# EAGLE design atmega328p (EAGLE 8.5.0)
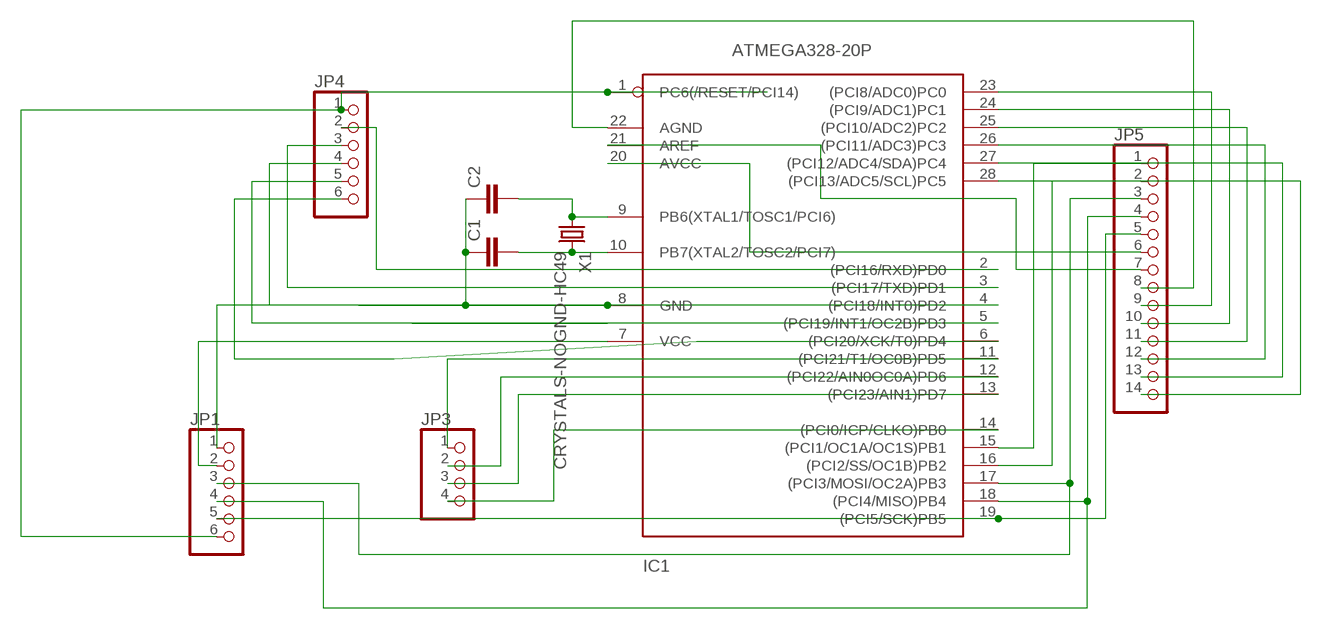
[diagram p0: schematic, sheet 1]

## Parts
C1  C5/2.5  [C5B2.5]
C2  C2.5/2  [C2.5-2]
IC1  ATMEGA328-20P  [DIL28-3]
JP1  PINHD-1X6  [1X06]
JP3  PINHD-1X4  [1X04]
JP4  PINHD-1X6  [1X06]
JP5  PINHD-1X14  [1X14]
X1  CRYSTALS-NOGND-HC49  [HC49]

## Nets
N$1: IC1.7(VCC) JP1.2
N$2: IC1.2((PCI16/RXD)PD0) JP4.2
N$3: C2.2 IC1.9(PB6(XTAL1/TOSC1/PCI6)) X1.1
N$4: C1.2 IC1.10(PB7(XTAL2/TOSC2/PCI7)) X1.2
N$5: C1.1 C2.1 IC1.8(GND) JP1.1
N$6: IC1.3((PCI17/TXD)PD1) JP4.3
N$7: IC1.1(PC6(/RESET/PCI14)) JP1.6 JP4.1
N$8: IC1.17((PCI3/MOSI/OC2A)PB3) JP1.3 JP5.3
N$10: IC1.19((PCI5/SCK)PB5) JP1.5 JP5.5
N$11: IC1.4((PCI18/INT0)PD2) JP4.4
N$12: IC1.5((PCI19/INT1/OC2B)PD3) JP4.5
N$13: IC1.6((PCI20/XCK/T0)PD4) JP4.6
N$14: IC1.11((PCI21/T1/OC0B)PD5) JP3.1
N$15: IC1.12((PCI22/AIN0OC0A)PD6) JP3.2
N$16: IC1.13((PCI23/AIN1)PD7) JP3.3
N$17: IC1.14((PCI0/ICP/CLKO)PB0) JP3.4
N$18: IC1.15((PCI1/OC1A/OC1S)PB1) JP5.1
N$19: IC1.16((PCI2/SS/OC1B)PB2) JP5.2
N$21: IC1.23((PCI8/ADC0)PC0) JP5.9
N$22: IC1.24((PCI9/ADC1)PC1) JP5.10
N$23: IC1.21(AREF) JP5.7
N$24: IC1.25((PCI10/ADC2)PC2) JP5.11
N$25: IC1.26((PCI11/ADC3)PC3) JP5.12
N$26: IC1.27((PCI12/ADC4/SDA)PC4) JP5.13
N$27: IC1.28((PCI13/ADC5/SCL)PC5) JP5.14
N$28: IC1.20(AVCC) JP5.6
N$30: IC1.22(AGND) JP5.8
N$31: IC1.18((PCI4/MISO)PB4) JP1.4 JP5.4

## Library data of the parts
C1 C2 = capacitor-wima:C: CAPACITOR naming: grid - package width
IC1 = atmega328:ATMEGA328*P: MICROCONTROLLER 32 kBytes FLASH 2 kBytes SRAM 1 kBytes EEPROM USART 8-channel 10 bit ADC
JP1 JP4 = pinhead:PINHD-1X6: PIN HEADER
JP3 = pinhead:PINHD-1X4: PIN HEADER
JP5 = pinhead:PINHD-1X14: PIN HEADER
X1 = IQD-Frequency-Products:CRYSTALS-NOGND: CRYSTALS CAN NOT GROUNDED

## Board
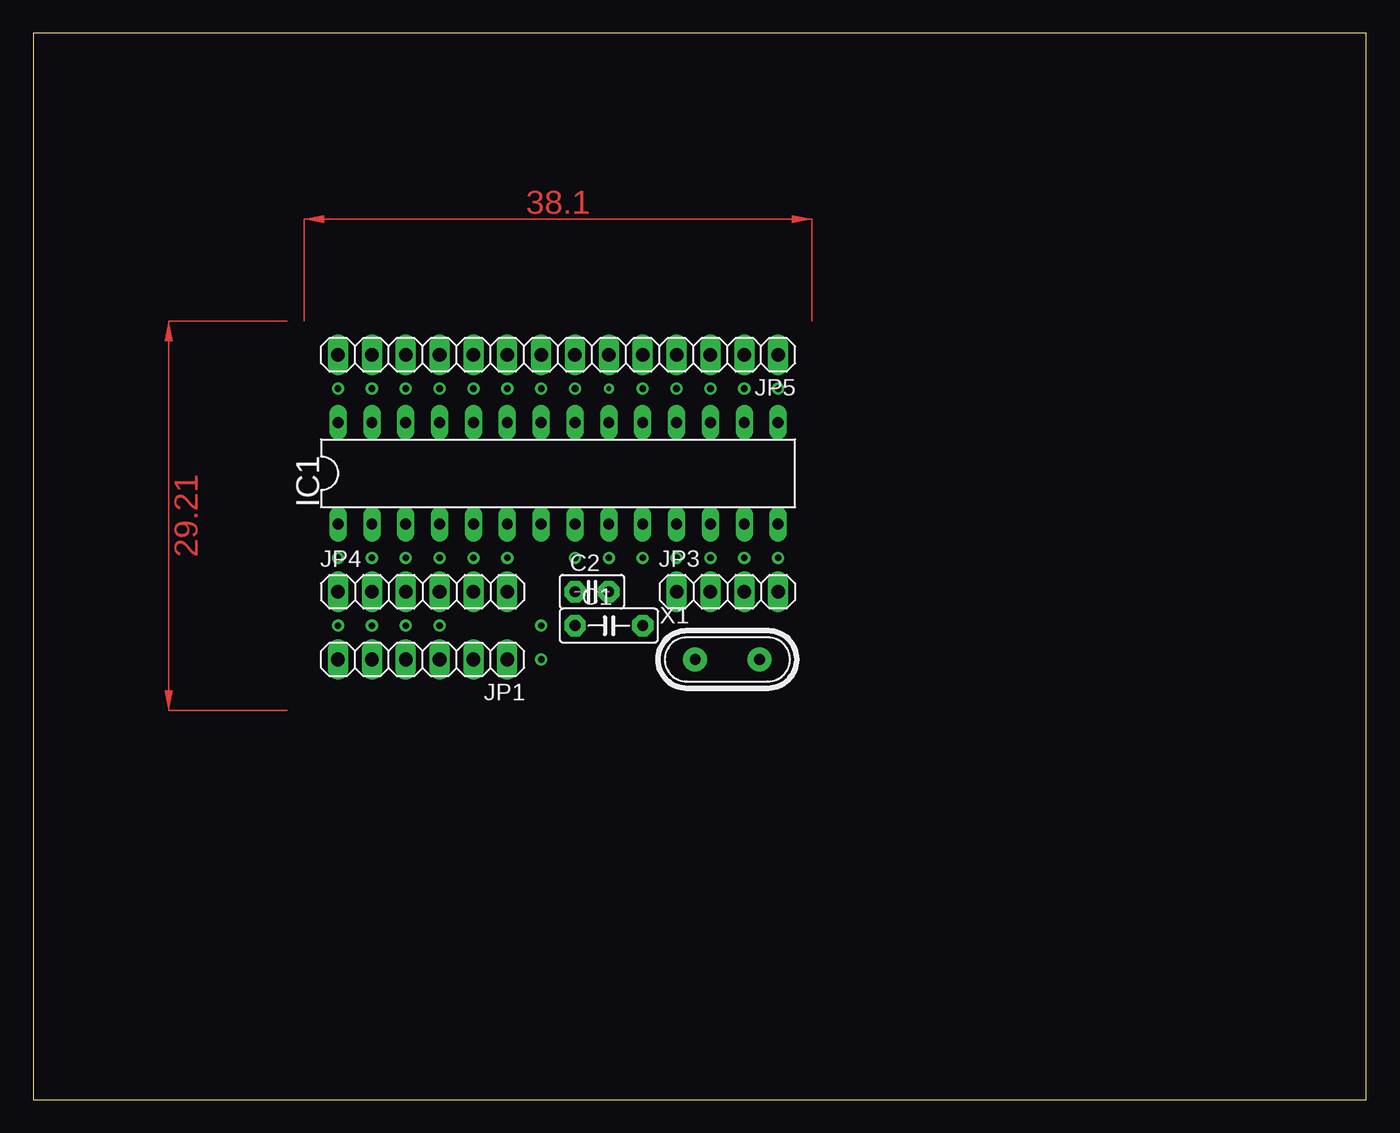
[diagram p1: board, top side]
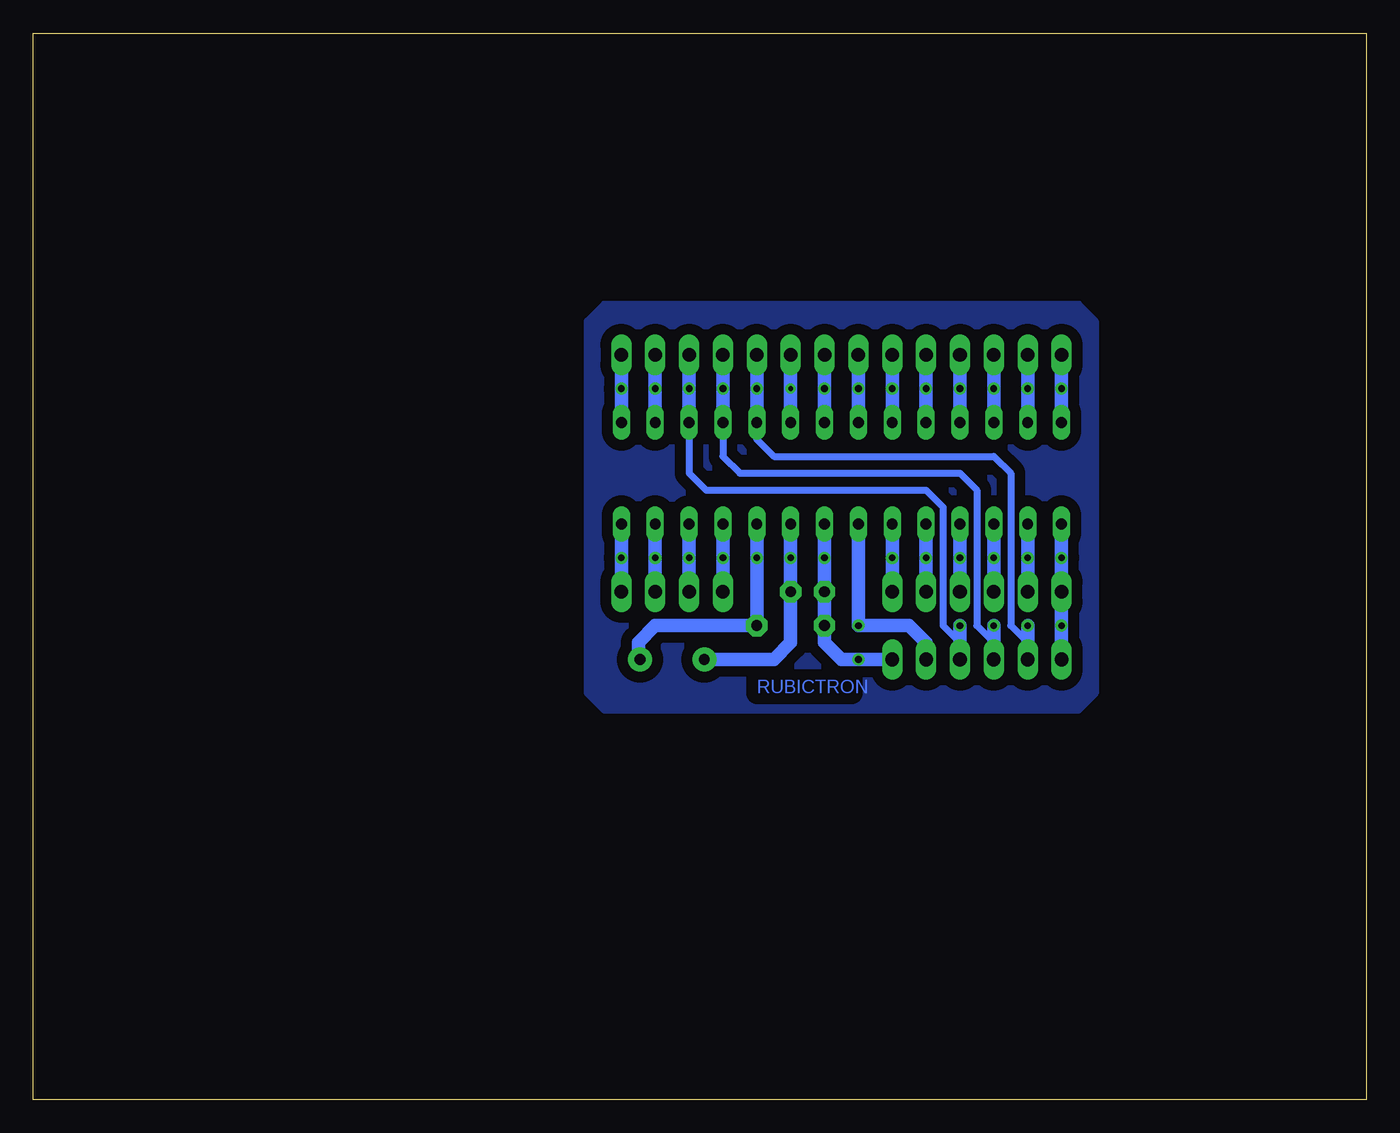
[diagram p2: board, bottom side, seen from below]

Size 100 x 80 mm. Coordinates in mm from the lower left corner, seen from the top.
Outline: 0,0 100,0 100,80 0,80 0,0
Copper layers (1*16): Top 0.035mm / dielectric 1.5mm / Bottom 0.035mm
Design rules "default": minimum track width 6mil, minimum drill 0.35mm, track to track 6mil, track to pad 6mil, pad to pad 6mil, via to via 6mil, smd to smd 6mil, copper to edge 40mil, drill to drill 6mil, minimum pad ring 10mil, minimum via ring 8mil, stop-mask expansion 4mil, vias tented up to drill 0mil, thermal gap 10mil

### Footprints (pad centres in the part's own frame; a part is rotated, then mirrored left to right if it is on the bottom)
C5B2.5 = drill 0.813 pad 1.6 octagon: 1 -2.54,0; 2 2.54,0
C2.5-2 = drill 0.813 pad 1.6 octagon: 1 -1.27,0; 2 1.27,0
DIL28-3 = drill 0.813 long: 1 -16.51,-3.81; 2 -13.97,-3.81; 3 -11.43,-3.81; 4 -8.89,-3.81; 5 -6.35,-3.81; 6 -3.81,-3.81; 7 -1.27,-3.81; 8 1.27,-3.81; 9 3.81,-3.81; 10 6.35,-3.81; 11 8.89,-3.81; 12 11.43,-3.81; 13 13.97,-3.81; 14 16.51,-3.81; 15 16.51,3.81; 16 13.97,3.81; 17 11.43,3.81; 18 8.89,3.81; 19 6.35,3.81; 20 3.81,3.81; 21 1.27,3.81; 22 -1.27,3.81; 23 -3.81,3.81; 24 -6.35,3.81; 25 -8.89,3.81; 26 -11.43,3.81; 27 -13.97,3.81; 28 -16.51,3.81
1X06 = drill 1.016 long: 1 -6.35,0; 2 -3.81,0; 3 -1.27,0; 4 1.27,0; 5 3.81,0; 6 6.35,0
1X04 = drill 1.016 long: 1 -3.81,0; 2 -1.27,0; 3 1.27,0; 4 3.81,0
1X14 = drill 1.016 long: 1 -16.51,0; 2 -13.97,0; 3 -11.43,0; 4 -8.89,0; 5 -6.35,0; 6 -3.81,0; 7 -1.27,0; 8 1.27,0; 9 3.81,0; 10 6.35,0; 11 8.89,0; 12 11.43,0; 13 13.97,0; 14 16.51,0
HC49 = drill 0.813 pad 1.8: 1 -2.413,0; 2 2.413,0

### Placement (x,y rotation side)
C1  43.18,35.56 0 top
C2  41.91,38.1 0 top
IC1  39.37,46.99 0 top
JP1  29.21,33.02 180 top
JP3  52.07,38.1 0 top
JP4  29.21,38.1 0 top
JP5  39.37,55.88 180 top
X1  52.07,33.02 0 top

### Tracks (layer width: path | path; a pad name or v marks a point on that pad's centre or on a via)
N$1  (via drill 0.5)
  Bottom 1.016: JP1.2 33.02,34.29 34.29,35.56 v38.1,35.56 IC1.7
N$2  (via drill 0.5)
  Bottom 1.016: IC1.2 v25.4,40.64 JP4.2
N$3  (via drill 0.5)
  Bottom 1.016: IC1.9 v43.18,40.64 C2.2 43.18,34.29 44.45,33.02 X1.1
N$4  (via drill 0.5)
  Bottom 1.016: IC1.10 v45.72,40.64 C1.2 53.34,35.56 54.61,34.29 54.61,33.02 X1.2
N$5  (via drill 0.35, 0.5)
  Bottom 1.016: IC1.8 v40.64,40.64 C2.1 C1.1 40.64,34.29 39.37,33.02 v38.1,33.02 JP1.1
  other vias: 40.64,43.18
N$6  (via drill 0.5)
  Bottom 1.016: IC1.3 v27.94,40.64 JP4.3
N$7  (via drill 0.5)
  Bottom 1.016: IC1.1 v22.86,40.64 JP4.1 v22.86,35.56 JP1.6
N$8  (via drill 0.5)
  Bottom 0.508: IC1.17 50.8,46.99 49.53,45.72 33.02,45.72 31.75,44.45 31.75,35.56 30.48,34.29 JP1.3
  Bottom 1.016: JP5.3 v50.8,53.34 IC1.17 | v30.48,35.56 JP1.3
N$10  (via drill 0.5)
  Bottom 0.508: IC1.19 45.72,49.53 44.45,48.26 27.94,48.26 26.67,46.99 26.67,35.56 | 26.67,35.56 25.4,34.29 | 26.67,35.56
  Bottom 1.016: JP5.5 v45.72,53.34 IC1.19 | JP1.5 25.4,34.29 v25.4,35.56
N$11  (via drill 0.5)
  Bottom 1.016: IC1.4 v30.48,40.64 JP4.4
N$12  (via drill 0.5)
  Bottom 1.016: IC1.5 v33.02,40.64 JP4.5
N$13  (via drill 0.5)
  Bottom 1.016: JP4.6 v35.56,40.64 IC1.6
N$14  (via drill 0.5)
  Bottom 1.016: IC1.11 v48.26,40.64 JP3.1
N$15  (via drill 0.5)
  Bottom 1.016: IC1.12 v50.8,40.64 JP3.2
N$16  (via drill 0.5)
  Bottom 1.016: IC1.13 v53.34,40.64 JP3.3
N$17  (via drill 0.5)
  Bottom 1.016: IC1.14 v55.88,40.64 JP3.4
N$18  (via drill 0.5)
  Bottom 1.016: JP5.1 v55.88,53.34 IC1.15
N$19  (via drill 0.5)
  Bottom 1.016: JP5.2 v53.34,53.34 IC1.16
N$20
  pour Bottom (isolate 0.813): 21.59,29.21 57.15,29.21 58.42,30.48 58.42,58.42 57.15,59.69 21.59,59.69 20.32,58.42 20.32,30.48
N$21  (via drill 0.5)
  Bottom 1.016: JP5.9 v35.56,53.34 IC1.23
N$22  (via drill 0.5)
  Bottom 1.016: JP5.10 v33.02,53.34 IC1.24
N$23  (via drill 0.5)
  Bottom 1.016: JP5.7 v40.64,53.34 IC1.21
N$24  (via drill 0.5)
  Bottom 1.016: JP5.11 v30.48,53.34 IC1.25
N$25  (via drill 0.5)
  Bottom 1.016: JP5.12 v27.94,53.34 IC1.26
N$26  (via drill 0.5)
  Bottom 1.016: JP5.13 v25.4,53.34 IC1.27
N$27  (via drill 0.5)
  Bottom 1.016: JP5.14 v22.86,53.34 IC1.28
N$28  (via drill 0.35)
  Bottom 1.016: JP5.6 v43.18,53.34 IC1.20
N$30  (via drill 0.5)
  Bottom 1.016: JP5.8 v38.1,53.34 IC1.22
N$31  (via drill 0.5)
  Bottom 0.508: IC1.18 48.26,48.26 46.99,46.99 30.48,46.99 29.21,45.72 29.21,35.56 27.94,34.29
  Bottom 1.016: JP5.4 v48.26,53.34 IC1.18 | 27.94,34.29 v27.94,35.56 JP1.4
(copper drawn outside any net)
  shapes: Top area x2

### Text on the board
Bottom: RUBICTRON